# Altium schematic sheet TIPD164_SCH.SchDoc
size 431 x 279 mm; Date: Not shown in title block; ApprovedBy: Not shown in title block; CheckedBy: Not shown in title block; Author: Not shown in title block; CompanyName: Not shown in title block; DrawnBy: Not shown in title block; Engineer: Not shown in title block; Organization: Not shown in title block; Address1: Not shown in title block; Address2: Not shown in title block; Address3: Not shown in title block; Address4: Not shown in title block; DocumentNumber: 1; Revision: A; SheetNumber: 1; SheetTotal: 1; PageSetup: Record=PageOptions|CenterHorizontal=True|CenterVertical=True|PrintScale=0.62|XCorrection=1.00|YCorrection=1.00|PrintKind=0|BorderSize=5000000|LeftOffset=0|BottomOffset=0|Orientation=2|PaperLength=1000|PaperWidth=1000|Scale=100|PaperSource=15|PrintQuality=600|MediaType=1|DitherType=10|PaperKind=Letter|PrintScaleMode=1; CurrentTime: Not shown in title block; CurrentDate: Not shown in title block; Time: Not shown in title block; DocumentFullPathAndName: Not shown in title block; DocumentName: Not shown in title block; ModifiedDate: Not shown in title block; ImagePath: Not shown in title block
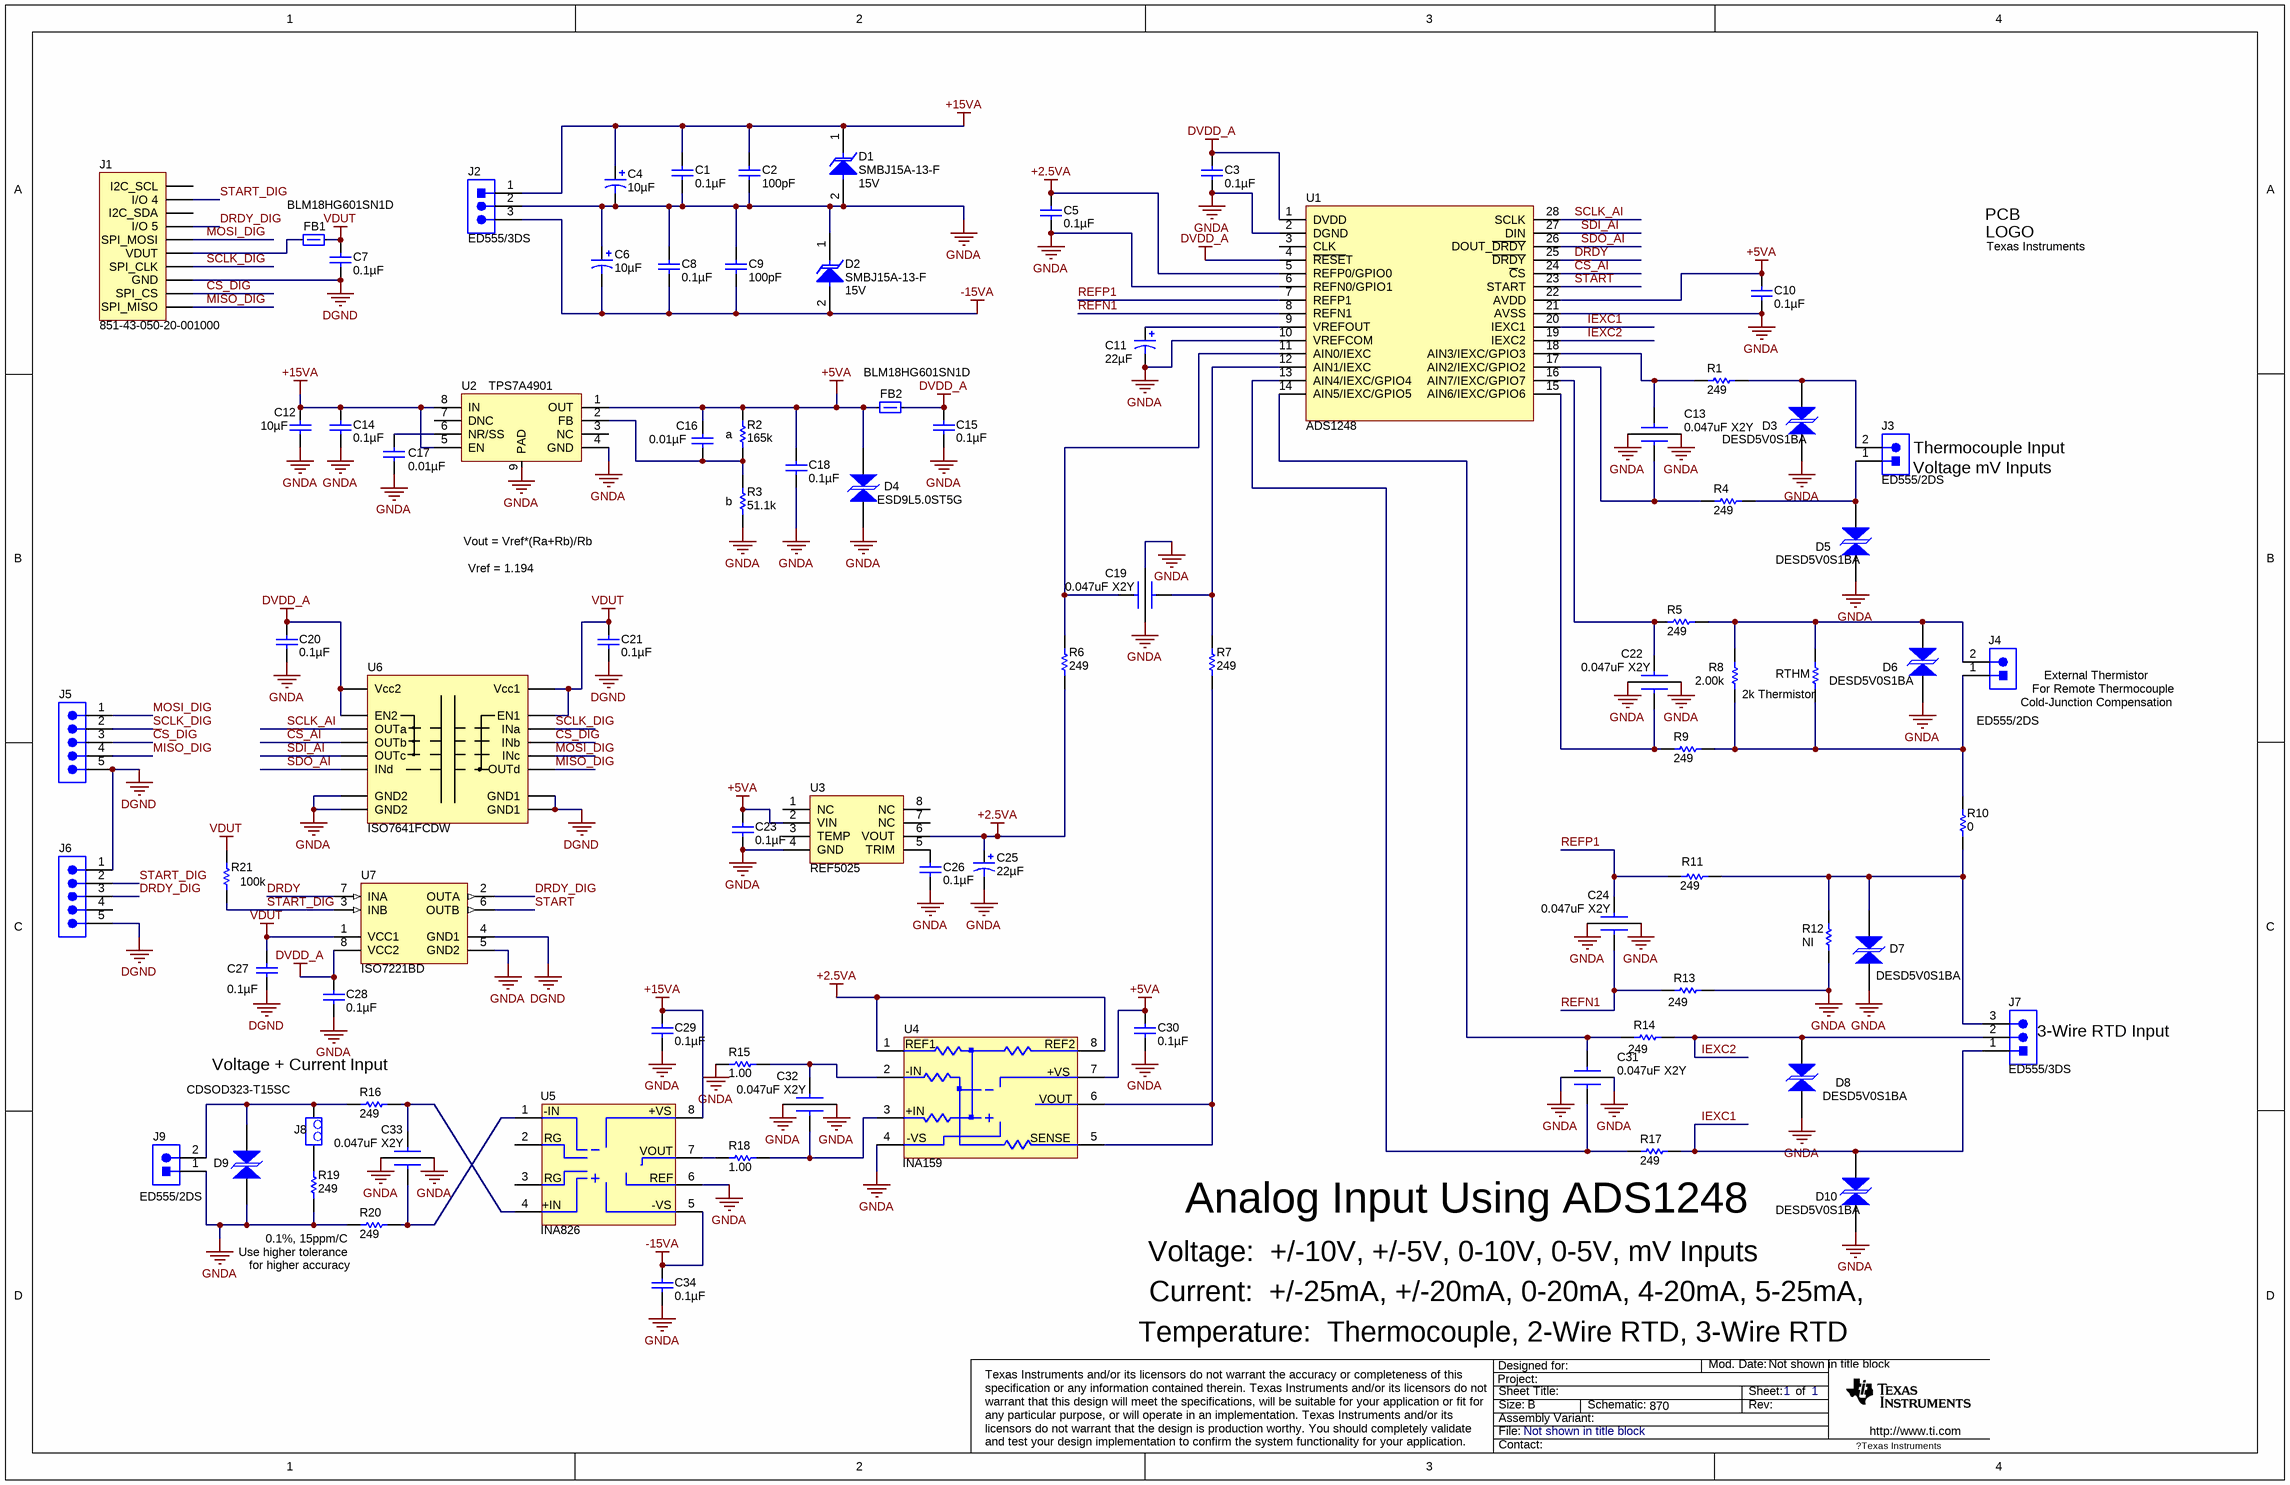
[diagram p0: TIPD164_SCH.SchDoc]

## Parts
C1  ValueDisplayed: 0.1µF  [0603]  (hidden comment: GRM188R71H104KA93D)
C2  ValueDisplayed: 100pF  [0603]  (hidden comment: 06035A101JAT2A)
C3  ValueDisplayed: 0.1µF  [0603]  (hidden comment: GRM188R71H104KA93D)
C4  ValueDisplayed: 10µF  [7343-43]  (hidden comment: 293D106X9050E2TE3)
C5  ValueDisplayed: 0.1µF  [0603]  (hidden comment: GRM188R71H104KA93D)
C6  ValueDisplayed: 10µF  [7343-43]  (hidden comment: 293D106X9050E2TE3)
C7  ValueDisplayed: 0.1µF  [0603]  (hidden comment: GRM188R71H104KA93D)
C8  ValueDisplayed: 0.1µF  [0603]  (hidden comment: GRM188R71H104KA93D)
C9  ValueDisplayed: 100pF  [0603]  (hidden comment: 06035A101JAT2A)
C10  ValueDisplayed: 0.1µF  [0603]  (hidden comment: GRM188R71H104KA93D)
C11  ValueDisplayed: 22µF  [6032-28]  (hidden comment: 293D226X9010C2TE3)
C12  ValueDisplayed: 10µF  [1210]  (hidden comment: C3225X7R1E106M)
C13  0.047uF X2Y  [X2Y_0603]
C14  ValueDisplayed: 0.1µF  [0603]  (hidden comment: GRM188R71H104KA93D)
C15  ValueDisplayed: 0.1µF  [0603]  (hidden comment: GRM188R71H104KA93D)
C16  ValueDisplayed: 0.01µF  [0603]  (hidden comment: C0603C103J5RACTU)
C17  ValueDisplayed: 0.01µF  [0603]  (hidden comment: C0603C103J5RACTU)
C18  ValueDisplayed: 0.1µF  [0603]  (hidden comment: GRM188R71H104KA93D)
C19  0.047uF X2Y  [X2Y_0603]
C20  ValueDisplayed: 0.1µF  [0603]  (hidden comment: GRM188R71H104KA93D)
C21  ValueDisplayed: 0.1µF  [0603]  (hidden comment: GRM188R71H104KA93D)
C22  0.047uF X2Y  [X2Y_0603]
C23  ValueDisplayed: 0.1µF  [0603]  (hidden comment: GRM188R71H104KA93D)
C24  0.047uF X2Y  [X2Y_0603]
C25  ValueDisplayed: 22µF  [6032-28]  (hidden comment: 293D226X9010C2TE3)
C26  ValueDisplayed: 0.1µF  [0603]  (hidden comment: GRM188R71H104KA93D)
C27  ValueDisplayed: 0.1µF  [0603]  (hidden comment: GRM188R71H104KA93D)
C28  ValueDisplayed: 0.1µF  [0603]  (hidden comment: GRM188R71H104KA93D)
C29  ValueDisplayed: 0.1µF  [0603]  (hidden comment: GRM188R71H104KA93D)
C30  ValueDisplayed: 0.1µF  [0603]  (hidden comment: GRM188R71H104KA93D)
C31  0.047uF X2Y  [X2Y_0603]
C32  0.047uF X2Y  [X2Y_0603]
C33  0.047uF X2Y  [X2Y_0603]
C34  ValueDisplayed: 0.1µF  [0603]  (hidden comment: GRM188R71H104KA93D)
D1  SMBJ15A-13-F  value 15V  [SMB]
D2  SMBJ15A-13-F  value 15V  [SMB]
D3  DESD5V0S1BA  [SOD-323]
D4  ESD9L5.0ST5G  [SOD-923]
D5  DESD5V0S1BA  [SOD-323]
D6  DESD5V0S1BA  [SOD-323]
D7  DESD5V0S1BA  [SOD-323]
D8  DESD5V0S1BA  [SOD-323]
D9  CDSOD323-T15SC  [sod-323]
D10  DESD5V0S1BA  [SOD-323]
FB1  BLM18HG601SN1D  [0603]
FB2  BLM18HG601SN1D  [0603]
J1  851-43-050-20-001000  [851-43-010-20-001000]
J2  ED555/3DS  [TERM_BLK_ED555-3DS]
J3  ED555/2DS  [TERM_BLK_ED555-2DS]
J4  ED555/2DS  [TERM_BLK_ED555-2DS]
J5  TSW-105-07-G-S  [TSW-105-07-G-S]  (value not drawn)
J6  TSW-105-07-G-S  [TSW-105-07-G-S]  (value not drawn)
J7  ED555/3DS  [TERM_BLK_ED555-3DS]
J8  TMS-102-02-G-S  [50mil Header]  (value not drawn)
J9  ED555/2DS  [TERM_BLK_ED555-2DS]
Logo?  Texas Instruments  [TI_Stacked_Overlay_Small]  (no BOM)
R1  value 249  [0603]  (hidden comment: CRCW0603249RFKEA)
R2  value 165k  [0603]  (hidden comment: ERA-3AEB1653V)
R3  value 51.1k  [0603]  (hidden comment: RG1608P-5112-B-T5)
R4  value 249  [0603]  (hidden comment: CRCW0603249RFKEA)
R5  value 249  [0603]  (hidden comment: RG1608P-2490-B-T5)
R6  value 249  [0603]  (hidden comment: CRCW0603249RFKEA)
R7  value 249  [0603]  (hidden comment: CRCW0603249RFKEA)
R8  value 2.00k  [0603]  (hidden comment: RG1608P-202-B-T5)
R9  value 249  [0603]  (hidden comment: RG1608P-2490-B-T5)
R10  value 0  [0603]  (hidden comment: CRCW06030000Z0EA)
R11  value 249  [0603]  (hidden comment: CRCW0603249RFKEA)
R12  value NI  [0603_HV]
R13  value 249  [0603]  (hidden comment: CRCW0603249RFKEA)
R14  value 249  [0603]  (hidden comment: CRCW0603249RFKEA)
R15  value 1.00  [0603]  (hidden comment: MCT06030C1008FP500)
R16  value 249  [0603]  (hidden comment: CRCW0603249RFKEA)
R17  value 249  [0603]  (hidden comment: CRCW0603249RFKEA)
R18  value 1.00  [0603]  (hidden comment: MCT06030C1008FP500)
R19  value 249  [2010]  (hidden comment: RT2010BKC07249RL)
R20  value 249  [0603]  (hidden comment: CRCW0603249RFKEA)
R21  value 100k  [0603]  (hidden comment: CRCW0603100KFKEA)
RTHM  value 2k Thermistor  [0603]  (hidden comment: NTCS0603E3202JLT)
U1  ADS1248  [MTC28_N]
U2  TPS7A4901  [MUY08A_N]
U3  REF5025  [MUA08A_N]
U4  INA159  [MUA08A_N]
U5  INA826  [MUA08A_N]
U6  ISO7641FCDW  [M16B_N]
U7  ISO7221BD  [D0008A_N]

## Nets
+2.5VA: C5.1 C25.1(+) R6.1 U1.5(REFP0/GPIO0) U3.6(VOUT) U4.1(REF1) U4.8(REF2)
+5VA: C10.1 C16.1 C18.1 C23.1 C30.1 D4.2 FB2.1 R2.1 U1.22(AVDD) U2.1(OUT) U3.2(VIN) U4.7(VOUT)
+15VA: C1.2 C2.1 C4.1(+) C12.1 C14.1 C29.1 D1.1(K) J2.1 U2.5(EN) U2.8(IN) U5.8(+VS)
-15VA: C6.2(-) C8.1 C9.2 C34.1 D2.2(A) J2.3 U5.5(-VS)
DGND: C7.2 C21.2 C27.2 J1.8(GND) J5.5 J6.1 J6.5 U6.2(GND1) U6.8(GND1) U7.4(GND1)
DVDD_A: C3.1 C15.1 C20.1 C28.1 FB2.2 U1.1(DVDD) U1.4(~{RESE}T) U6.10(EN2) U6.16(Vcc2) U7.8(VCC2)
GNDA: C1.1 C2.2 C3.2 C4.2(-) C5.2 C6.1(+) C8.2 C9.1 C10.2 C11.2(-) C12.2 C13.3 C13.4 C14.2 C15.2 C17.2 C18.2 C19.3 C19.4 C20.2 C22.3 C22.4 C23.2 C24.3 C24.4 C25.2(-) C26.2 C28.2 C29.2 C30.2 C31.3 C31.4 C32.3 C32.4 C33.3 C33.4 C34.2 D1.2(A) D2.1(K) D3.2 D4.1 D5.2 D6.2 D7.2 D8.2 D9.2 D10.2 J2.2 J9.1 R3.1 R12.2 R13.2 R15.1 R19.1 R20.1 U1.2(DGND) U1.6(REFN0/GPIO1) U1.10(VREFCOM) U1.21(AVSS) U2.4(GND) U2.9(PAD) U3.4(GND) U4.4(V-) U5.6(REF) U6.9(GND2) U6.15(GND2) U7.5(GND2)
VDUT: C7.1 C21.1 C27.1 FB1.2 R21.2 U6.1(Vcc1) U6.7(EN1) U7.1(VCC1)
~{C}S_DIG: J1.9(SPI_CS) J5.3 U6.4(INb)
~{CS}_AI: U1.24(~{C}S) U6.13(OUTb)
DRDY: U1.25(~{DRDY}) U7.7(INA)
DRDY_DIG: J1.4(I/O_5) J6.3 U7.2(OUTA)
IEXC1: D10.1 J7.1 R17.2 U1.20(IEXC1)
IEXC2: D8.1 J7.2 R14.2 U1.19(IEXC2)
MISO_DIG: J1.10(SPI_MISO) J5.4 U6.6(OUTd)
MOSI_DIG: J1.5(SPI_MOSI) J5.1 U6.5(INc)
REFN1: C24.2 R13.1 U1.8(REFN1)
REFP1: C24.1 R11.1 U1.7(REFP1)
SCLK_AI: U1.28(SCLK) U6.14(OUTa)
SCLK_DIG: J1.7(SPI_CLK) J5.2 U6.3(INa)
SDI_AI: U1.27(DIN) U6.12(OUTc)
SDO_AI: U1.26(DOUT_~{DRDY}) U6.11(INd)
START: U1.23(START) U7.6(OUTB)
START_DIG: J1.2(I/O_4) J6.2 R21.1 U7.3(INB)
NetC11_1: C11.1(+) U1.9(VREFOUT)
NetC13_1: C13.1 R1.1 U1.18(AIN3/IEXC/GPIO3)
NetC13_2: C13.2 R4.1 U1.17(AIN2/IEXC/GPIO2)
NetC16_2: C16.2 R2.2 R3.2 U2.2(FB)
NetC17_1: C17.1 U2.6(NR/SS)
NetC19_1: C19.1 R7.2 U1.12(AIN1/IEXC)
NetC19_2: C19.2 R6.2 U1.11(AIN0/IEXC)
NetC22_1: C22.1 R5.1 U1.16(AIN7/IEXC/GPIO7)
NetC22_2: C22.2 R9.1 U1.15(AIN6/IEXC/GPIO6)
NetC26_1: C26.1 U3.5(TRIM)
NetC31_1: C31.1 R14.1 U1.14(AIN5/IEXC/GPIO5)
NetC31_2: C31.2 R17.1 U1.13(AIN4/IEXC/GPIO4)
NetC32_1: C32.1 R15.2 U4.2(-IN)
NetC32_2: C32.2 R18.2 U4.3(+IN)
NetC33_1: C33.1 R16.2 U5.4(+IN)
NetC33_2: C33.2 R20.2 U5.1(-IN)
NetD3_1: D3.1 J3.2 R1.2
NetD5_1: D5.1 J3.1 R4.2
NetD6_1: D6.1 J4.2 R5.2 R8.2 RTHM.2
NetD7_1: D7.1 J7.3 R10.1 R11.2 R12.1
NetD9_1: D9.1 J8.1 J9.2 R16.1
NetFB1_1: FB1.1 J1.6(VDUT)
NetJ4_1: J4.1 R8.1 R9.2 R10.2 RTHM.1
NetJ8_2: J8.2 R19.2
NetR7_1: R7.1 U4.5(SENSE) U4.6(OUT)
NetR18_1: R18.1 U5.7(VOUT)

Not connected (* = marked no-connect by the designer): J1 1(I2C_SCL) 3(I2C_SDA); J6 4; U1 3(CLK); U2 3(NC) 7(DNC); U3 1(NC) 3(TEMP) 7(NC) 8(NC); U5 2(RG) 3(RG)

## Notes on the sheet
- (near R2) a
- (near R3) b
- (near J3) Voltage mV Inputs
- (near J3) Thermocouple Input
- Vref = 1.194
- Vout = Vref*(Ra+Rb)/Rb
- (near J4) External Thermistor
- (near J4) Cold-Junction Compensation
- (near J4) For Remote Thermocouple
- (near J7) 3-Wire RTD Input
- Voltage + Current Input
- (near R20) 0.1%, 15ppm/C
- (near R17) Analog Input Using ADS1248
- (near R20) Use higher tolerance
- (near R20) for higher accuracy
- Voltage:  +/-10V, +/-5V, 0-10V, 0-5V, mV Inputs
- Current:  +/-25mA, +/-20mA, 0-20mA, 4-20mA, 5-25mA,
- Temperature:  Thermocouple, 2-Wire RTD, 3-Wire RTD
- Project:
- Designed for:
- Mod. Date:
- Sheet Title:
- Size:
- File:
- Assembly Variant:
- B
- Schematic:
- 870
- Rev:
- Sheet:
- of
- http://www.ti.com
- Texas Instruments and/or its licensors do not warrant the accuracy or completeness of this specification or any information contained therein. Texas Instruments and/or its licensors do not warrant that this design will meet the specifications, will be suitable for your application or fit for any particular purpose, or will operate in an implementation. Texas Instruments and/or its licensors do not warrant that the design is production worthy. You should completely validate and test your design implementation to confirm the system functionality for your application.
- Contact:
- ?Texas Instruments
- (in symbol INA159) .; +VS; -VS
- (in symbol TI_Logo) PCB; LOGO

## Library data of the parts
C1 C3 C5 C7 C8 C10 C14 C15 C18 C20 C21 C23 C26-C30 C34 = GRM188R71H104KA93D: CAP, CERM, 0.1uF, 50V, +/-10%, X7R, 0603; Manufacturer: MuRata; Polarized: N; CompType: Capacitor; U/M: EA; Cap_F: 0.0000001; Tolerance_%: 10; VDC_V: 50; TaMin_C: -55; TaMax_C: 125; SymbolVersion: 2008-07-09; Value: 0.1uF; PartNumber: GRM188R71H104KA93D; PackageReference: 0603; RoHS: Y; Value1: ?; Value2: 50V; MountType: SMT; Technology: Ceramic; TempCo: X7R; Cap_Case: 0603; Published: 2008-06-19; Publisher: Texas Instruments; LatestRevisionDate: 2012-04-11; LatestRevisionNote: Changed publisher; ComponentLink1Description: Datasheet link; ComponentLink1URL: http://search.murata.co.jp/Ceramy/PnsearchViewAction.do?HnOFG=ON&HnNFG=ON&SEL_CNT=50&sLang=en&sKey=GRM188R71H104KA93D&x=9&y=9&search=startwith; Alternate PartNumber: -; Alternate Manufacturer: -; Supplier 1: Digi-Key; Supplier Part Number 1: 490-1519-1-ND; Supplier 2: Farnell; Supplier Part Number 2: 1118182; Supplier 3: Arrow; Supplier Part Number 3: GRM188R71H104KA93D
C2 C9 = 06035A101JAT2A: CAP, CERM, 100pF, 50V, +/-5%, C0G/NP0, 0603; Manufacturer: AVX; Polarized: N; CompType: Capacitor; U/M: EA; Cap_F: 0.0000000001; Tolerance_%: 5; ESR_Ohm: 0.119; Value1: 0.119 ohm; VDC_V: 50; TaMin_C: -55; TaMax_C: 125; SymbolVersion: 2008-07-09; Value: 100pF; PartNumber: 06035A101JAT2A; PackageReference: 0603; RoHS: Y; Value2: 50V; MountType: SMT; Technology: Ceramic; TempCo: C0G/NP0; Cap_Case: 0603; Published: 2008-06-19; Publisher: Texas Instruments; LatestRevisionDate: 2012-05-14; LatestRevisionNote: Changed publisher; ComponentLink1Description: Datasheet link; ComponentLink1URL: http://www.avx.com/docs/masterpubs/smccp.pdf; Alternate PartNumber: -; Alternate Manufacturer: -; Supplier 1: Digi-Key; Supplier Part Number 1: 478-1175-1-ND; Supplier 2: Farnell; Supplier Part Number 2: 4766040; Supplier 3: Newark; Supplier Part Number 3: 96K4763
C4 C6 = 293D106X9050E2TE3: CAP, TANT, 10uF, 50V, +/-10%, 0.8 ohm, 7343-43 SMD; Manufacturer: Vishay-Sprague; Polarized: Y; CompType: Capacitor; U/M: EA; Cap_F: 0.00001; Tolerance_%: 10; Value1: 0.8 ohm; VDC_V: 50; ESR_Ohm: 0.8; IRMS_A: 0.45; TaMin_C: -55; TaMax_C: 125; Cap_Case: E; SymbolVersion: 2008-07-09; Value: 10uF; PartNumber: 293D106X9050E2TE3; PackageReference: 7343-43; RoHS: Y; Value2: 50V; MountType: SMT; Technology: TA; Series: 293D; Published: 2008-06-19; Publisher: Texas Instruments; LatestRevisionDate: 2012-04-11; LatestRevisionNote: Changed Publisher; ComponentLink1Description: Datasheet link; ComponentLink1URL: http://www.vishay.com/docs/40002/293d.pdf; Alternate PartNumber: -; Alternate Manufacturer: -; Supplier 1: Digi-Key; Supplier Part Number 1: 718-1022-1-ND; Supplier 2: Farnell; Supplier Part Number 2: 1203693; Supplier 3: Newark; Supplier Part Number 3: 65K2822
C11 C25 = 293D226X9010C2TE3: CAP, TANT, 22uF, 10V, +/-10%, 1.5 ohm, 6032-28 SMD; Manufacturer: Vishay-Sprague; Polarized: Y; CompType: Capacitor; U/M: EA; Cap_F: 0.000022; Tolerance_%: 10; Value1: 1.5 ohm; ESR_Ohm: 1.5; IRMS_A: 0.27; TaMin_C: -55; TaMax_C: 125; Cap_Case: C; SymbolVersion: 2008-07-09; Value: 22uF; PartNumber: 293D226X9010C2TE3; PackageReference: 6032-28; RoHS: Y; VDC_V: 10; Value2: 10V; MountType: SMT; Technology: TA; Series: 293D; Published: 2008-06-19; Publisher: Texas Instruments; LatestRevisionDate: 2012-04-11; LatestRevisionNote: Changed Publisher; ComponentLink1Description: Datasheet link; ComponentLink1URL: http://www.vishay.com/docs/40002/293d.pdf; Alternate PartNumber: -; Alternate Manufacturer: -; Supplier 1: Digi-Key; Supplier Part Number 1: 718-1065-1-ND; Supplier 2: Farnell; Supplier Part Number 2: 9303596; Supplier 3: Newark; Supplier Part Number 3: 09K6238
C12 = C3225X7R1E106M: CAP, CERM, 10uF, 25V, +/-20%, X7R, 1210; Manufacturer: TDK; Polarized: N; CompType: Capacitor; U/M: EA; Cap_F: 0.00001; Tolerance_%: 20; ESR_Ohm: 0.0027; Value1: 0.0027 ohm; VDC_V: 25; IRMS_A: 3; TaMin_C: -55; TaMax_C: 125; SymbolVersion: 2008-07-09; Value: 10uF; PartNumber: C3225X7R1E106M; PackageReference: 1210; RoHS: Y; Value2: 25V; MountType: SMT; Technology: Ceramic; TempCo: X7R; Cap_Case: 1210; Published: 2008-06-19; Publisher: Texas Instruments; LatestRevisionDate: 2012-04-11; LatestRevisionNote: Changed publisher; ComponentLink1Description: Datasheet link; ComponentLink1URL: http://www.tdk.co.jp/tefe02/e412_c.pdf; Alternate PartNumber: -; Alternate Manufacturer: -; Supplier 1: Digi-Key; Supplier Part Number 1: 445-1434-1-ND; Supplier 2: Arrow; Supplier Part Number 2: C3225X7R1E106M
C13 C19 C22 C24 C31-C33 = X2Y Capacitor: CAP CER 0.047UF 16V 20% X7R 0603; Manufacturer: Johanson Dielectrics Inc; PartNumber: 160X14W473MV4T; U/M: EA; TaMax_C: 125; TaMin_C: -55; Tolerance%: +/-20; MountType: SMT; RoHS: Y; PackageReference: 0603; CompType: Capacitor; Supplier1: Digi-Key; Supplier Part Number 1: 709-1088-1-ND; TempCo: X7R; Value: 0.047uF; Value1: *; Value2: 16V
C16 C17 = C0603C103J5RACTU: CAP, CERM, 0.01uF, 50V, +/-5%, X7R, 0603; Manufacturer: Kemet; Polarized: N; CompType: Capacitor; U/M: EA; Cap_F: 0.00000001; Tolerance_%: 5; VDC_V: 50; TaMin_C: -55; TaMax_C: 125; SymbolVersion: 2008-07-09; Value: 0.01uF; PartNumber: C0603C103J5RACTU; PackageReference: 0603; RoHS: Y; Value1: ?; Value2: 50V; MountType: SMT; Technology: Ceramic; TempCo: X7R; Cap_Case: 0603; Published: 2008-06-19; Publisher: Texas Instruments; LatestRevisionDate: 2012-04-11; LatestRevisionNote: Changed publisher; ComponentLink1Description: Datasheet link; ComponentLink1URL: http://www.kemet.com/kemet/web/homepage/kechome.nsf/vapubfiles/F3102_Y5V.pdf/$file/F3102_Y5V.pdf; Alternate PartNumber: -; Alternate Manufacturer: -; Supplier 1: Digi-Key; Supplier Part Number 1: 399-1092-1-ND
D1 D2 = SMBJ15A-13-F: Diode, TVS, Uni, 15V, 600W, SMB; Manufacturer: Diodes Inc.; U/M: EA; Power_W: 5; Vr_V: 15; Value1: 5W; CompType: TVS; SymbolVersion: 2012-01-13; PartNumber: SMBJ15A-13-F; PackageReference: SMB; Vz_V: N/A; MountType: SMT; RoHS: Y; ComponentLink1Description: Datasheet link; ComponentLink1URL: http://www.diodes.com/datasheets/ds19002.pdf; Published: 2008-10-08; Publisher: Texas Instruments; LatestRevisionDate: 2012-01-16; LatestRevisionNote: Added TVS diodes; Alternate Manufacturer: -; Alternate PartNumber: -; Supplier 1: Digi-Key; Supplier Part Number 1: SMBJ15A-FDICT-ND
D3 D5-D8 D10 = SMAJ15CA: DIODE TVS 5.0V 130W; Manufacturer: Diodes.inc; SymbolCreator: Use LDAP id; U/M: EA, IN, or GM; RoHS: Y; PartNumber: DESD5V0S1BA; ComponentLink1URL: http://www.diodes.com/datasheets/ds31275.pdf; CompType: TVS; Alternate PartNumber: -; Alternate Manufacturer: -; Supplier 1: Digi-Key
D4 = SMAJ15CA: TVS ESD PROT ULT LOW CAP SOD-923; Manufacturer: ON Semiconductor; SymbolVersion: use current date i.e. 2008-05-20; SymbolCreator: Use LDAP id; U/M: EA, IN, or GM; MountType: SMT; RoHS: Y; PartNumber: ESD9L5.0ST5G; PackageReference: SMA; ComponentLink1Description: Datasheet Link; ComponentLink1URL: http://www.digikey.com/product-detail/en/SMAJ15CA/SMAJ15CABCT-ND/2254248; CompType: TVS; Alternate PartNumber: -; Alternate Manufacturer: -; Supplier Part Number 1: ESD9L5.0ST5GOSCT-ND
D9 = SMAJ15CA: DIODE TVS ARRAY 15V SOD323; Manufacturer: Bourns; SymbolVersion: use current date i.e. 2008-05-20; SymbolCreator: Use LDAP id; U/M: EA, IN, or GM; MountType: SMT; RoHS: Y; PartNumber: CDSOD323-T15SC; PackageReference: SMA; ComponentLink1Description: Datasheet Link; CompType: TVS; Alternate PartNumber: -; Alternate Manufacturer: -; Supplier Part Number 1: CDSOD323-T15SCCT-ND; Supplier 1: Digi-Key
FB1 FB2 = Ferrite_Bead: FERRITE CHIP 600 OHM 200MA 0603; Manufacturer: MuRata; U/M: EA; CompType: Ferrite; SymbolVersion: 2009-06-02; PackageReference: 0603; PartNumber: BLM18HG601SN1D; RoHS: Y; MountType: SMT; Publisher: Texas Instruments; Alternate Manufacturer: -; Alternate PartNumber: -; Supplier1: Digi-Key; Supplier Part Number 1: 490-1033-1-ND
J1 = SM-USB-DIG-CONN: CONN SOCKET 50PIN .050 R/A SNGL; Manufacturer: Mill-Max Manufacturing Corp.; SymbolCreator: Use LDAP id; U/M: EA, IN, or GM; SymbolVersion: 2012-6-15; MountType: TH; RoHS: Y; PartNumber: 851-43-050-20-001000; PackageReference: eg:  0603, used in PnP report; ComponentLink1Description: http://mill-max.net/sockets/so_productinfo.cfm?searchBasicPartNumber=851&searchClipGrid=20&searchPinWindowPattern=001&searchInsulatorPinClipType=000&start=1&search_description2=-&search_rows=&options=true&d_options=true&SEARCHPLATINGOPTIONS=&SEARCH_NUMBEROFPINS=&thumbnail=71rtas.gif; CompType: Conn; Alternate PartNumber: -; Alternate Manufacturer: -; Supplier Part Number 1: ED90278-ND
J2 J7 = ED555/3DS: Terminal Block, 6A, 3.5mm Pitch, 3-Pos, TH; Manufacturer: On-Shore Technology; SymbolCreator: a0799628; CompType: Connector; U/M: EA; SymbolVersion: 2013-03-28; PartNumber: ED555/3DS; PackageReference: 10.5x8.2x6.5mm; RoHS: Y; MountType: TH; ComponentLink1Description: Datasheet Link; ComponentLink1URL: http://on-shore.com/sites/default/files/manuals/ed555ds.pdf; Publisher: Texas Instruments; LatestRevisionDate: 2014-01-27; Supplier 1: Digi-Key; Supplier Part Number 1: ED1515-ND
J3 J4 J9 = ED555/2DS: Terminal Block, 6A, 3.5mm Pitch, 2-Pos, TH; Manufacturer: On-Shore Technology; SymbolCreator: a0412235; CompType: Connector; U/M: EA; SymbolVersion: 2013-10-31; PartNumber: ED555/2DS; PackageReference: 7.0x8.2x6.5mm; RoHS: Y; MountType: TH; ComponentLink1Description: Datasheet Link; ComponentLink1URL: http://on-shore.com/sites/default/files/manuals/ed555ds.pdf; Publisher: Texas Instruments; LatestRevisionDate: 2014-01-27; Supplier 1: Digi-Key; Supplier Part Number 1: ED1514-ND
J5 J6 = TSW-105-07-G-S: Header, TH, 100mil, 5x1, Gold plated, 230 mil above insulator; Manufacturer: Samtec, Inc.; SymbolCreator: a0412235; U/M: EA; SymbolVersion: 2013-03-16; PartNumber: TSW-105-07-G-S; ClassName: Header; CompType: Header; RoHS: Y; PackageReference: 5x1 Header; MountType: TH; ComponentLink1Description: Datasheet Link; ComponentLink1URL: http://samtec.com/ftppub/pdf/TSW_TH.PDF; Publisher: Texas Instruments; LatestRevisionDate: 2013-06-04; Supplier 1: Digi-Key; Supplier Part Number 1: SAM1029-05-ND
J8 = Shunt: CONN HEADER 2POS .050" T/H GOLD; Manufacturer: Samtec; SymbolVersion: use current date i.e. 2008-05-20; SymbolCreator: Use LDAP id; CompType: JMP; U/M: EA, IN, or GM; MountType: SMT; RoHS: Y; PartNumber: TMS-102-02-G-S; PackageReference: eg:  0603, used in PnP report; ComponentLink1Description: Datasheet Link; Alternate PartNumber: -; Alternate Manufacturer: -; Supplier Part Number 1: TMS-102-02-G-S-ND; Supplier 1: Digi-Key
Logo? = TI_Logo: Texas Instrument Corporate Signature; SymbolCreator: a0412235; SymbolVersion: 2011-08-22; ClassName: Logo; Published: 2009-03-03; Publisher: Texas Instruments; LatestRevisionDate: 2014-01-07
R1 R4 R6 R7 R11 R13 R14 R16 R17 R20 = CRCW0603249RFKEA: RES, 249 ohm, 1%, 0.1W, 0603; Manufacturer: Vishay-Dale; CompType: Resistor; Value_Code: 249R; Tolerance_%: 1; Power_W: 0.1; VDC_V: 75; TempCo: 100 ppm/C; EIA_Code: E96; U/M: EA; SymbolVersion: 2009-05-29; PartNumber: CRCW0603249RFKEA; PackageReference: 0603; RoHS: Y; Res_ohm: 249; Value1: 1%; Value2: 0.1W; MountType: SMT; Technology: Thick Film; Published: 2008-06-26; Publisher: Texas Instruments; LatestRevisionDate: 2012-04-20; LatestRevisionNote: Changed publisher; ComponentLink1Description: Datasheet link; ComponentLink1URL: http://www.vishay.com/docs/20035/dcrcwe3.pdf; Alternate PartNumber: -; Alternate Manufacturer: -; Supplier 1: Digi-Key; Supplier Part Number 1: 541-249HCT-ND; Supplier 2: Farnell; Supplier Part Number 2: 1210043; Supplier 3: Newark; Supplier Part Number 3: 52K8327
R2 = RT0603BRD07164KL: RES 165K OHM 1/10W .1% 0603 SMD; Manufacturer: Panasonic Electronic Components; CompType: Resistor; Res_ohm: 165000; Tolerance_%: 0.1; Value1: 0.1%; Value2: 0.1W; VDC_V: 75; TempCo: 25 ppm/C; EIA_Code: E192; U/M: EA; SymbolVersion: 2009-05-29; PartNumber: ERA-3AEB1653V; PackageReference: 0603; RoHS: Y; Value_Code: 165k; Power_W: 0.1; MountType: SMT; Technology: Thin Film; Published: 2008-06-26; Publisher: Texas Instruments; LatestRevisionDate: 2012-04-20; LatestRevisionNote: Changed publisher; ComponentLink1Description: Datasheet link; ComponentLink1URL: http://www.yageo.com/pdf/PYu-RT_1-to-0.05_RoHS_L_3.pdf; Alternate PartNumber: -; Alternate Manufacturer: -; Supplier 1: Digi-Key; Supplier Part Number 1: P165KDBCT-ND
R3 = RG1608P-5112-B-T5: RES, 51.1k ohm, 0.1%, 0.1W, 0603; Manufacturer: Susumu Co Ltd; CompType: Resistor; Res_ohm: 51100; Value_Code: 51k1; Tolerance_%: 0.1; VDC_V: 75; TempCo: 25 ppm/C; EIA_Code: E192; U/M: EA; SymbolVersion: 2009-05-29; PartNumber: RG1608P-5112-B-T5; PackageReference: 0603; RoHS: Y; Value1: 0.1%; Power_W: 0.1; Value2: 0.1W; MountType: SMT; Technology: Metal Film; Published: 2008-06-26; Publisher: Texas Instruments; LatestRevisionDate: 2012-04-20; LatestRevisionNote: Changed publisher; ComponentLink1Description: Datasheet link; ComponentLink1URL: http://www.susumu.co.jp/english/pdf/products-j01-01.pdf; Alternate PartNumber: -; Alternate Manufacturer: -; Supplier 1: Digi-Key; Supplier Part Number 1: RG16P51.1KBCT-ND
R5 = CRCW0603249RFKEA: RES 249 OHM 1/10W .1% 0603 SMD; Manufacturer: Susumu; CompType: Resistor; Value_Code: 249R; Tolerance_%: 0.1; VDC_V: 75; TempCo: 25 ppm/C; EIA_Code: E96; U/M: EA; SymbolVersion: 2009-05-29; PartNumber: RG1608P-2490-B-T5; PackageReference: 0603; RoHS: Y; Res_ohm: 249; MountType: SMT; Technology: Thick Film; Alternate PartNumber: -; Alternate Manufacturer: -; Supplier 1: Digi-Key; Supplier Part Number 1: RG16P249BCT-ND
R8 = RG1608P-202-B-T5: RES, 2.00k ohm, 0.1%, 0.1W, 0603; Manufacturer: Susumu Co Ltd; CompType: Resistor; Res_ohm: 2000; Value_Code: 2k00; Tolerance_%: 0.1; VDC_V: 75; TempCo: 25 ppm/C; EIA_Code: E192; U/M: EA; SymbolVersion: 2009-05-29; PartNumber: RG1608P-202-B-T5; PackageReference: 0603; RoHS: Y; Value1: 0.1%; Power_W: 0.1; Value2: 0.1W; MountType: SMT; Technology: Metal Film; Published: 2008-06-26; Publisher: Texas Instruments; LatestRevisionDate: 2014-01-08; ComponentLink1Description: Datasheet link; ComponentLink1URL: http://www.susumu.co.jp/english/pdf/products-j01-01.pdf; Supplier 1: Digi-Key; Supplier Part Number 1: RG16P2.0KBCT-ND; Supplier 2: Mouser; Supplier Part Number 2: 754-RG1608P-202-B-T5; Supplier 3: Farnell; Supplier Part Number 3: 1796946
R9 = CRCW0603249RFKEA: RES 249 OHM 1/10W .1% 0603 SMD; Manufacturer: Susumu; CompType: Resistor; Value_Code: 249R; Tolerance_%: 0.1; Value1: 0.1%; Value2: 0.1W; VDC_V: 75; TempCo: 25 ppm/C; EIA_Code: E96; U/M: EA; PartNumber: RG1608P-2490-B-T5; PackageReference: 0603; RoHS: Y; Res_ohm: 249; Power_W: 0.1; MountType: SMT; Technology: Thick Film; Publisher: Texas Instruments; Alternate PartNumber: -; Alternate Manufacturer: -; Supplier 1: Digi-Key; Supplier Part Number 1: RG16P249BCT-ND
R10 = CRCW06030000Z0EA: RES, 0 ohm, 5%, 0.1W, 0603; Manufacturer: Vishay-Dale; CompType: Resistor; Value_Code: 0000; Tolerance_%: 5; Power_W: 0.1; VDC_V: 75; TempCo: 200 ppm/C; EIA_Code: E24; U/M: EA; SymbolVersion: 2009-05-29; PartNumber: CRCW06030000Z0EA; PackageReference: 0603; RoHS: Y; Res_ohm: 0; Value1: 5%; Value2: 0.1W; MountType: SMT; Technology: Thick Film; Published: 2008-06-26; Publisher: Texas Instruments; LatestRevisionDate: 2012-04-20; LatestRevisionNote: Changed publisher; ComponentLink1Description: Datasheet link; ComponentLink1URL: http://www.vishay.com/docs/20035/dcrcwe3.pdf; Alternate PartNumber: -; Alternate Manufacturer: -; Supplier 1: Digi-Key; Supplier Part Number 1: 541-0.0GCT-ND; Supplier 2: Farnell; Supplier Part Number 2: 1288408; Supplier 3: Newark; Supplier Part Number 3: 52K8014
R12 = RC0603FR-078K2L: NI; CompType: Resistor; Res_ohm: 8200; Value_Code: 8k20; Tolerance_%: 1; Value1: 0.2%; Power_W: 0.1; Value2: 0.125W; VDC_V: 150; TempCo: 5 ppm/C; U/M: EA; SymbolVersion: 2009-05-29; PackageReference: 0603; RoHS: Y; MountType: SMT; Technology: Thick Film; Published: 2008-06-26; Publisher: Texas Instruments; LatestRevisionDate: 2012-04-20; LatestRevisionNote: Changed publisher; ComponentLink1Description: Datasheet link; ComponentLink1URL: http://www.yageo.com/pdf/Pu-RC0603_51_PbFree_L_2.pdf; Alternate PartNumber: -; Alternate Manufacturer: -; Supplier 1: Digi-Key
R15 R18 = CRCW06031R00FKEA: RES 1.00 OHM 1/8W 1% SMD 0603; Manufacturer: Vishay Beyschlag; CompType: Resistor; Res_ohm: 1; Value_Code: 1R00; Power_W: 0.125; Value2: 0.1W; VDC_V: 75; TempCo: 50 ppm/C; EIA_Code: E96; U/M: EA; SymbolVersion: 2009-05-29; PartNumber: MCT06030C1008FP500; PackageReference: 0603; RoHS: Y; Tolerance_%: 1; Value1: 1%; MountType: SMT; Technology: Thick Film; Published: 2008-06-26; Publisher: Texas Instruments; LatestRevisionDate: 2012-04-20; LatestRevisionNote: Changed publisher; ComponentLink1Description: Datasheet link; ComponentLink1URL: http://www.vishay.com/docs/20035/dcrcwe3.pdf; Alternate PartNumber: -; Alternate Manufacturer: -; Supplier 1: Digi-Key; Supplier Part Number 1: MCT0603-1.00-CFCT-ND
R19 = CRCW1206249RFKEA: RES 249 OHM 1/2W .1% 2010 SMD; Manufacturer: Yageo; Upgrade PartNumber: PLTT250ACT-ND; Upgrade Manufacturer: Vishay Thin Film; CompType: Resistor; Value_Code: 249R; Tolerance_%: 0.1; Value1: 1%; Power_W: 0.5; Value2: 0.25W; VDC_V: 200; TempCo: +/-15 ppm/C; EIA_Code: E96; U/M: EA; Upgrade Specs: 0.02%, 5ppm; SymbolVersion: 2009-05-29; PartNumber: RT2010BKC07249RL; PackageReference: 2010; RoHS: Y; Res_ohm: 249; MountType: SMT; Technology: Thick Film; Supplier 1: Digi-Key; Supplier Part Number 1: 311-249NFCT-ND
R21 = CRCW0603100KFKEA: RES, 100k ohm, 1%, 0.1W, 0603; Manufacturer: Vishay-Dale; CompType: Resistor; Res_ohm: 100000; Tolerance_%: 1; Power_W: 0.1; VDC_V: 75; TempCo: 100 ppm/C; EIA_Code: E96; U/M: EA; SymbolVersion: 2009-05-29; PartNumber: CRCW0603100KFKEA; PackageReference: 0603; RoHS: Y; Value_Code: 100k; Value1: 1%; Value2: 0.1W; MountType: SMT; Technology: Thick Film; Published: 2008-06-26; Publisher: Texas Instruments; LatestRevisionDate: 2013-08-23; ComponentLink1Description: Datasheet link; ComponentLink1URL: http://www.vishay.com/docs/20035/dcrcwe3.pdf; Supplier 1: Digi-Key; Supplier Part Number 1: 541-100KHCT-ND; Supplier 2: Mouser; Supplier Part Number 2: 71-CRCW0603-100K-E3; Supplier 3: Farnell; Supplier Part Number 3: 1469649
RTHM = CRCW0603100KJNEA: THERMISTOR NTC 2K 5% 0603; Manufacturer: Vishay-Dale; CompType: Resistor; Tolerance_%: 5; Power_W: 0.1; Value2: 0.1W; VDC_V: 75; EIA_Code: E24; U/M: EA; PartNumber: NTCS0603E3202JLT; PackageReference: 0603; RoHS: Y; Value_Code: 2k; Value1: 5%; MountType: SMT; Publisher: Texas Instruments; LatestRevisionDate: 2012-04-20; LatestRevisionNote: Changed publisher; ComponentLink1Description: Datasheet link; ComponentLink1URL: http://www.vishay.com/docs/20035/dcrcwe3.pdf; Alternate PartNumber: -; Alternate Manufacturer: -; Supplier 1: Digi-Key; Supplier Part Number 1: BC2477CT-ND
U1 = ADS1248: IC ADC 24BIT DEL/SIG LN 28TSSOP; Manufacturer: Texas Instruments Inc; PartNumber: ADS1248IPW; SymbolVersion: use current date i.e. 2008-05-20; SymbolCreator: Use LDAP id; U/M: EA, IN, or GM; MountType: SMT; RoHS: Y; PackageReference: TSSOP28; ComponentLink1Description: Datasheet Link; CompType: ADC; Alternate PartNumber: -; Alternate Manufacturer: -; Supplier 1: Digi-Key; Supplier Part Number 1: 296-24294-5-ND
U2 = TPS7A4901: IC REG LDO ADJ .15A 8MSOP; Manufacturer: Texas Instruments Inc; PartNumber: TPS7A4901DGNR; SymbolVersion: use current date i.e. 2008-05-20; SymbolCreator: Use LDAP id; CompType: TPS; U/M: EA, IN, or GM; MountType: SMT; RoHS: Used in BOM report.  Use Y or N.; PackageReference: MSOP8; ComponentLink1Description: Datasheet Link; Alternate PartNumber: -; Alternate Manufacturer: -; Supplier Part Number 1: 296-27751-1-ND; Supplier 1: Digi-Key
U3 = REF5025: IC VREF SERIES PREC 2.5V 8-MSOP; Manufacturer: Texas Instruments Inc; PartNumber: REF5025IDGKT; SymbolVersion: use current date i.e. 2008-05-20; SymbolCreator: Use LDAP id; CompType: REF; U/M: EA, IN, or GM; MountType: SMT; RoHS: Y; PackageReference: MSOP8; ComponentLink1Description: Datasheet Link; Alternate PartNumber: -; Alternate Manufacturer: -; Supplier Part Number 1: 296-24499-1-ND; Supplier 1: Digi-Key
U4 = INA159: IC OPAMP DIFF 1.5MHZ SGL 8MSOP; Manufacturer: Texas Instruments Inc; PartNumber: INA159AIDGKT; SymbolVersion: use current date i.e. 2008-05-20; SymbolCreator: Use LDAP id; CompType: Used in some BOM reports.  Useful for finding later.; U/M: EA, IN, or GM; MountType: SMT; RoHS: Y; PackageReference: MSOP8; ComponentLink1Description: Datasheet Link; Alternate PartNumber: -; Alternate Manufacturer: -; Supplier Part Number 1: 296-18688-1-ND
U5 = INA826: IC OPAMP INSTR 1MHZ 8MSOP; Manufacturer: Texas Instruments Inc; PartNumber: INA826AIDGKR; SymbolVersion: use current date i.e. 2008-05-20; SymbolCreator: Use LDAP id; CompType: Used in some BOM reports.  Useful for finding later.; U/M: EA, IN, or GM; MountType: SMT; RoHS: Y; PackageReference: eg:  0603, used in PnP report; ComponentLink1Description: Datasheet Link; Alternate PartNumber: -; Alternate Manufacturer: -; Supplier Part Number 1: 296-29663-1-ND; Supplier 1: Digi-Key
U6 = ISO7241: ISOLATOR DGTL 25MBPS 4CH 16SOIC; Manufacturer: Texas Instruments Inc; SymbolVersion: use current date i.e. 2008-05-20; SymbolCreator: Use LDAP id; CompType: Used in some BOM reports.  Useful for finding later.; U/M: EA, IN, or GM; MountType: SMT; RoHS: Y; PartNumber: ISO7641FCDW; PackageReference: SOIC-16; ComponentLink1Description: http://www.ti.com/lit/ds/symlink/iso7241c.pdf; Alternate PartNumber: -; Alternate Manufacturer: -; Supplier Part Number 1: ISO7641FCDW-ND
U7 = ISO7221BD: 5 Mbps Dual Channels, 1 / 1, Digital Isolator, 3.3 V / 5 V, -40 to +125 degC, 8-pin SOIC (D), Green (RoHS & no Sb/Br); Manufacturer: Texas Instruments; Alternate Manufacturer: None; Alternate PartNumber: Equivalent; Datarate(Mbps): 5; Input Noise Filter: Yes; Insulation Rating(VRMS): 2500; Rating: Catalog; Supply Voltage(s)(V): 3.3, 5; TTL/CMOS Input Threshold: TTL; DatasheetVersion: SLLS755L; PackageVersion: revM, Jun-2011; PackageReference: D0008A; PackageDescription: 8-Pin Plastic Small Outline Integrated Circuit, 4.9 x 3.9 mm, Pitch 1.27 mm Pitch; Supplier 1: Digi-Key; Supplier Part Number 1: 296-23344-5-ND; Supplier 2: Farnell; Supplier Part Number 2: 1600639; Supplier 3: Newark; Supplier Part Number 3: 94M7889; Supplier 4: Mouser; Supplier Part Number 4: 595-ISO7221BD; Channel Configuration: 02/01/2000; Eco-Plan: Green (RoHS & no Sb/Br); SubFamily: Isolator; Thermal Shutdown: No; MountType: SMT; Code_JEDEC: MS-012AA; PartNumber: ISO7221BD; ComponentLink1Description: Datasheet; ComponentLink1URL: http://www.ti.com/general/docs/lit/getliterature.tsp?genericPartNumber=ISO7221B&fileType=pdf; ComponentLink2Description: URL Link1; ComponentLink2URL: SamplesURL:http://www.ti.com/product/iso7221b#samples